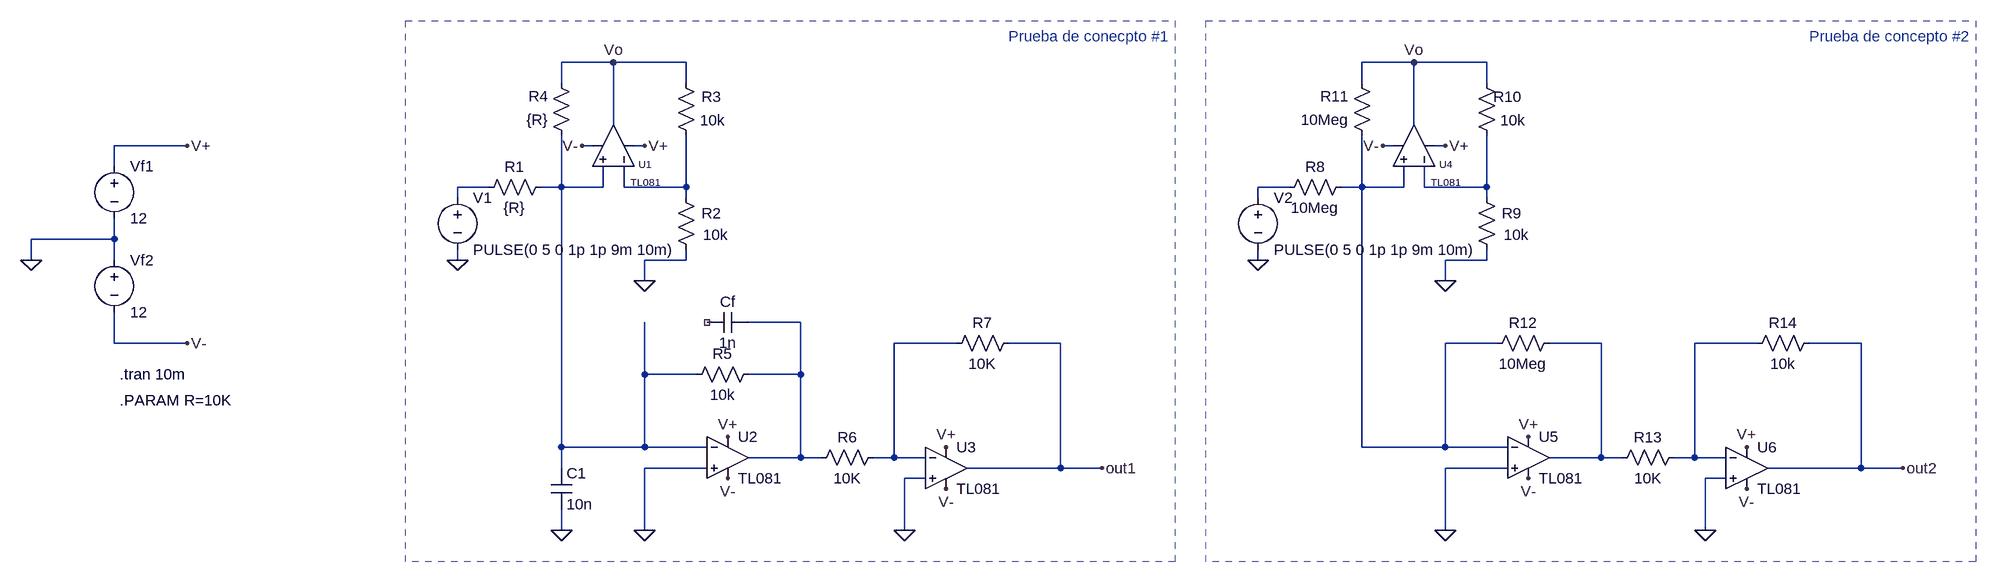
[diagram p0: schematic amplifier_new.asc]
amplifier_new.asc, the LTspice schematic file:
Version 4
SHEET 1 2560 772
WIRE 448 0 368 0
WIRE 560 0 448 0
WIRE 1680 0 1600 0
WIRE 1792 0 1680 0
WIRE 368 32 368 0
WIRE 560 32 560 0
WIRE 1600 32 1600 0
WIRE 1792 32 1792 0
WIRE 448 96 448 0
WIRE 1680 96 1680 0
WIRE -208 128 -320 128
WIRE 416 128 400 128
WIRE 496 128 480 128
WIRE 1648 128 1632 128
WIRE 1728 128 1712 128
WIRE -320 160 -320 128
WIRE 256 192 208 192
WIRE 368 192 368 112
WIRE 368 192 336 192
WIRE 432 192 432 160
WIRE 432 192 368 192
WIRE 464 192 464 160
WIRE 560 192 560 112
WIRE 560 192 464 192
WIRE 1488 192 1440 192
WIRE 1600 192 1600 112
WIRE 1600 192 1568 192
WIRE 1664 192 1664 160
WIRE 1664 192 1600 192
WIRE 1696 192 1696 160
WIRE 1792 192 1792 112
WIRE 1792 192 1696 192
WIRE 208 208 208 192
WIRE 560 208 560 192
WIRE 1440 208 1440 192
WIRE 1792 208 1792 192
WIRE -320 272 -320 240
WIRE -320 272 -448 272
WIRE -448 304 -448 272
WIRE -320 304 -320 272
WIRE 208 304 208 288
WIRE 560 304 560 288
WIRE 560 304 496 304
WIRE 1440 304 1440 288
WIRE 1792 304 1792 288
WIRE 1792 304 1728 304
WIRE 496 336 496 304
WIRE 1728 336 1728 304
WIRE 736 400 656 400
WIRE -320 432 -320 384
WIRE -208 432 -320 432
WIRE 976 432 880 432
WIRE 1136 432 1056 432
WIRE 1808 432 1728 432
WIRE 1968 432 1888 432
WIRE 2208 432 2112 432
WIRE 2368 432 2288 432
WIRE 496 480 496 400
WIRE 576 480 496 480
WIRE 736 480 736 400
WIRE 736 480 656 480
WIRE 368 592 368 192
WIRE 496 592 496 480
WIRE 496 592 368 592
WIRE 592 592 496 592
WIRE 1600 592 1600 192
WIRE 1728 592 1728 432
WIRE 1728 592 1600 592
WIRE 1824 592 1728 592
WIRE 736 608 736 480
WIRE 736 608 656 608
WIRE 768 608 736 608
WIRE 880 608 880 432
WIRE 880 608 848 608
WIRE 928 608 880 608
WIRE 1968 608 1968 432
WIRE 1968 608 1888 608
WIRE 2000 608 1968 608
WIRE 2112 608 2112 432
WIRE 2112 608 2080 608
WIRE 2160 608 2112 608
WIRE 368 624 368 592
WIRE 592 624 496 624
WIRE 1136 624 1136 432
WIRE 1136 624 992 624
WIRE 1200 624 1136 624
WIRE 1824 624 1728 624
WIRE 2368 624 2368 432
WIRE 2368 624 2224 624
WIRE 2432 624 2368 624
WIRE 928 640 896 640
WIRE 2160 640 2128 640
WIRE 368 720 368 688
WIRE 496 720 496 624
WIRE 896 720 896 640
WIRE 1728 720 1728 624
WIRE 2128 720 2128 640
FLAG 496 336 0
FLAG 496 128 V+
FLAG 448 0 Vo
FLAG -208 128 V+
FLAG -208 432 V-
FLAG -448 304 0
FLAG 400 128 V-
FLAG 624 576 V+
FLAG 624 640 V-
FLAG 496 720 0
FLAG 368 720 0
FLAG 208 304 0
FLAG 896 720 0
FLAG 960 592 V+
FLAG 960 656 V-
FLAG 1200 624 out1
FLAG 1728 336 0
FLAG 1728 128 V+
FLAG 1680 0 Vo
FLAG 1632 128 V-
FLAG 1856 576 V+
FLAG 1856 640 V-
FLAG 1728 720 0
FLAG 1440 304 0
FLAG 2128 720 0
FLAG 2192 592 V+
FLAG 2192 656 V-
FLAG 2432 624 out2
SYMBOL AutoGenerated\\TL081 448 128 M270
WINDOW 0 -18 -49 VBottom 1
WINDOW 3 -46 -49 VBottom 1
SYMATTR InstName U1
SYMATTR Value TL081
SYMBOL voltage 208 192 R0
WINDOW 123 0 0 Left 0
WINDOW 39 0 0 Left 0
SYMATTR InstName V1
SYMATTR Value PULSE(0 5 0 1p 1p 9m 10m)
SYMBOL res 352 176 R90
WINDOW 0 0 56 VBottom 2
WINDOW 3 32 56 VTop 2
SYMATTR InstName R1
SYMATTR Value {R}
SYMBOL res 576 304 R180
WINDOW 0 -38 72 Left 2
WINDOW 3 -49 39 Left 2
SYMATTR InstName R2
SYMATTR Value 10k
SYMBOL res 576 128 R180
WINDOW 0 -38 75 Left 2
WINDOW 3 -44 39 Left 2
SYMATTR InstName R3
SYMATTR Value 10k
SYMBOL res 384 128 R180
WINDOW 0 36 76 Left 2
WINDOW 3 36 40 Left 2
SYMATTR InstName R4
SYMATTR Value {R}
SYMBOL voltage -320 144 R0
WINDOW 123 0 0 Left 0
WINDOW 39 0 0 Left 0
SYMATTR InstName Vf1
SYMATTR Value 12
SYMBOL voltage -320 288 R0
WINDOW 123 0 0 Left 0
WINDOW 39 0 0 Left 0
SYMATTR InstName Vf2
SYMATTR Value 12
SYMBOL AutoGenerated\\TL081 624 608 R0
SYMATTR InstName U2
SYMATTR Value TL081
SYMBOL res 672 464 R90
WINDOW 0 0 56 VBottom 2
WINDOW 3 32 56 VTop 2
SYMATTR InstName R5
SYMATTR Value 10k
SYMBOL cap 352 624 R0
SYMATTR InstName C1
SYMATTR Value 10n
SYMBOL res 864 592 R90
WINDOW 0 0 56 VBottom 2
WINDOW 3 32 56 VTop 2
SYMATTR InstName R6
SYMATTR Value 10K
SYMBOL AutoGenerated\\TL081 960 624 R0
SYMATTR InstName U3
SYMATTR Value TL081
SYMBOL res 1072 416 R90
WINDOW 0 0 56 VBottom 2
WINDOW 3 32 56 VTop 2
SYMATTR InstName R7
SYMATTR Value 10K
SYMBOL AutoGenerated\\TL081 1680 128 M270
WINDOW 0 -18 -49 VBottom 1
WINDOW 3 -46 -49 VBottom 1
SYMATTR InstName U4
SYMATTR Value TL081
SYMBOL voltage 1440 192 R0
WINDOW 123 0 0 Left 0
WINDOW 39 0 0 Left 0
SYMATTR InstName V2
SYMATTR Value PULSE(0 5 0 1p 1p 9m 10m)
SYMBOL res 1584 176 R90
WINDOW 0 0 56 VBottom 2
WINDOW 3 32 56 VTop 2
SYMATTR InstName R8
SYMATTR Value 10Meg
SYMBOL res 1808 304 R180
WINDOW 0 -38 72 Left 2
WINDOW 3 -49 39 Left 2
SYMATTR InstName R9
SYMATTR Value 10k
SYMBOL res 1808 128 R180
WINDOW 0 -38 75 Left 2
WINDOW 3 -44 39 Left 2
SYMATTR InstName R10
SYMATTR Value 10k
SYMBOL res 1616 128 R180
WINDOW 0 36 76 Left 2
WINDOW 3 36 40 Left 2
SYMATTR InstName R11
SYMATTR Value 10Meg
SYMBOL AutoGenerated\\TL081 1856 608 R0
SYMATTR InstName U5
SYMATTR Value TL081
SYMBOL res 1904 416 R90
WINDOW 0 0 56 VBottom 2
WINDOW 3 32 56 VTop 2
SYMATTR InstName R12
SYMATTR Value 10Meg
SYMBOL res 2096 592 R90
WINDOW 0 0 56 VBottom 2
WINDOW 3 32 56 VTop 2
SYMATTR InstName R13
SYMATTR Value 10K
SYMBOL AutoGenerated\\TL081 2192 624 R0
SYMATTR InstName U6
SYMATTR Value TL081
SYMBOL res 2304 416 R90
WINDOW 0 0 56 VBottom 2
WINDOW 3 32 56 VTop 2
SYMATTR InstName R14
SYMATTR Value 10k
SYMBOL cap 656 384 R90
WINDOW 0 0 32 VBottom 2
WINDOW 3 32 32 VTop 2
SYMATTR InstName Cf
SYMATTR Value 1n
TEXT -312 480 Left 2 !.tran 10m
TEXT -312 520 Left 2 !.PARAM R=10K
TEXT 1056 -40 Left 2 ;Prueba de conecpto #1
TEXT 2288 -40 Left 2 ;Prueba de concepto #2
RECTANGLE Normal 1312 768 128 -64 2
RECTANGLE Normal 2544 768 1360 -64 2

The netlist it stands for:
* amplifier_new.asc
* U1: TL081 (symbol AutoGenerated\TL081 not available, pins judged from their places): In+=N002 In-=N003 V+=V+ V-=V- OUT=Vo
V1 N001 0 PULSE(0 5 0 1p 1p 9m 10m)
R1 N002 N001 {R}
R2 0 N003 10k
R3 N003 Vo 10k
R4 N002 Vo {R}
Vf1 V+ 0 12
Vf2 0 V- 12
* U2: TL081 (symbol AutoGenerated\TL081 not available, pins judged from their places): In+=0 In-=N002 V+=V+ V-=V- OUT=N007
R5 N007 N002 10k
C1 N002 0 10n
R6 N008 N007 10K
* U3: TL081 (symbol AutoGenerated\TL081 not available, pins judged from their places): In+=0 In-=N008 V+=V+ V-=V- OUT=out1
R7 out1 N008 10K
* U4: TL081 (symbol AutoGenerated\TL081 not available, pins judged from their places): In+=N005 In-=N006 V+=V+ V-=V- OUT=Vo
V2 N004 0 PULSE(0 5 0 1p 1p 9m 10m)
R8 N005 N004 10Meg
R9 0 N006 10k
R10 N006 Vo 10k
R11 N005 Vo 10Meg
* U5: TL081 (symbol AutoGenerated\TL081 not available, pins judged from their places): In+=0 In-=N005 V+=V+ V-=V- OUT=N009
R12 N009 N005 10Meg
R13 N010 N009 10K
* U6: TL081 (symbol AutoGenerated\TL081 not available, pins judged from their places): In+=0 In-=N010 V+=V+ V-=V- OUT=out2
R14 out2 N010 10k
Cf N007 NC_01 1n
.tran 10m
.PARAM R=10K
* Prueba de conecpto #1
* Prueba de concepto #2
.backanno
.end